# EAGLE design untitled (EAGLE 9.6.2)
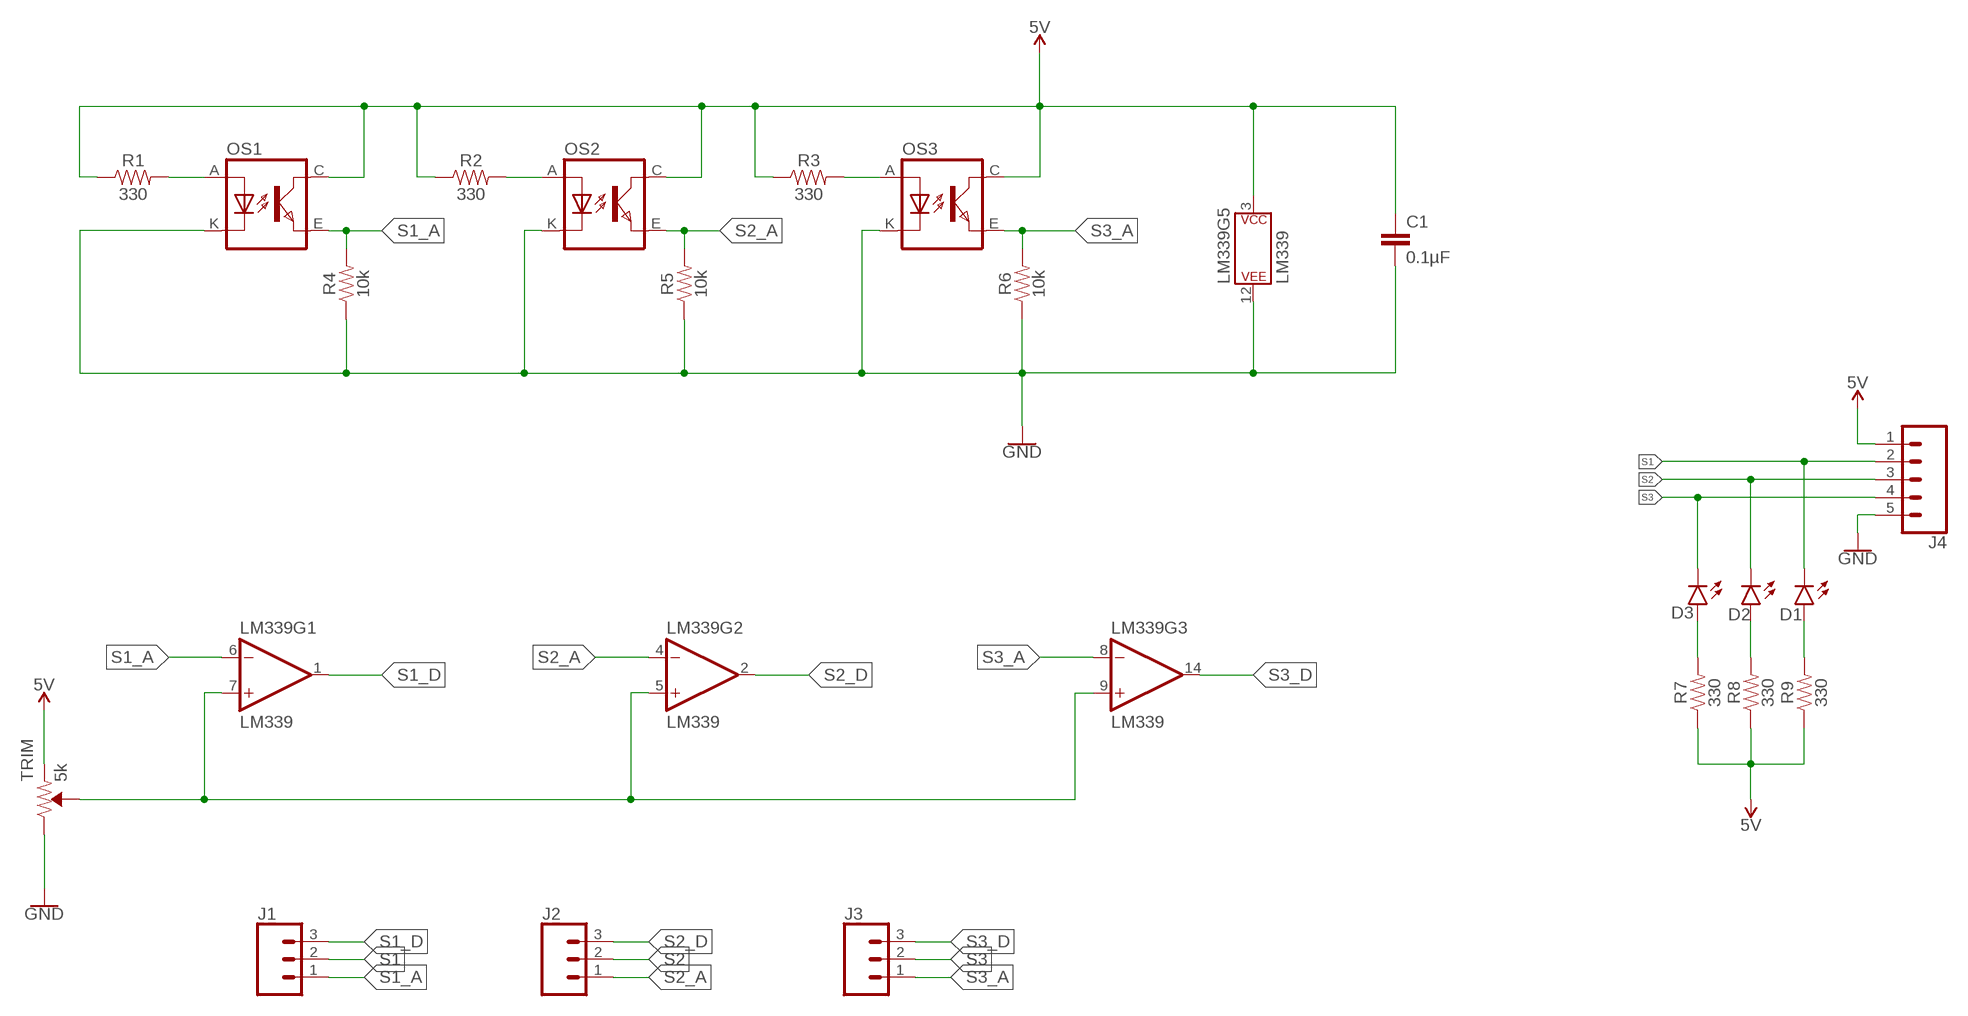
[diagram p0: schematic, sheet 1]

## Parts
C1  0.1µF  0.33UF/330NF-0805-50V-10%  [0805]
D1  LED-RED-0805  [LED-0805]
D2  LED-RED-0805  [LED-0805]
D3  LED-RED-0805  [LED-0805]
J1  CONN_03  [1X03]
J2  CONN_03  [1X03]
J3  CONN_03  [1X03]
J4  CONN_05PTH  [1X05]
LM339  LM339  [TSSOP-14]
OS1  TCRT5000  [TCRT5000]
OS2  TCRT5000  [TCRT5000]
OS3  TCRT5000  [TCRT5000]
R1  330  0.3OHM-0805-1/8W-1%  [0805]
R2  330  0.3OHM-0805-1/8W-1%  [0805]
R3  330  0.3OHM-0805-1/8W-1%  [0805]
R4  10k  0.3OHM-0805-1/8W-1%  [0805]
R5  10k  0.3OHM-0805-1/8W-1%  [0805]
R6  10k  0.3OHM-0805-1/8W-1%  [0805]
R7  330  0.3OHM-0805-1/8W-1%  [0805]
R8  330  0.3OHM-0805-1/8W-1%  [0805]
R9  330  0.3OHM-0805-1/8W-1%  [0805]
TRIM  5k  TRIMPOT-SMD-5MM-CLOSED-1/4W-20%  [TRIMPOT-SMD-5MM]

## Nets
5V: C1.1 J4.1 LM339.3(P$V+) OS1.C(COLLECTOR) OS2.C(COLLECTOR) OS3.C(COLLECTOR) R1.1 R2.1 R3.1 R7.1 R8.1 R9.1 TRIM.A(CCW)
GND: C1.2 J4.5 LM339.12(P$V-) OS1.K(CATHODE) OS2.K(CATHODE) OS3.K(CATHODE) R4.1 R5.1 R6.1 TRIM.C(CW)
N$1: OS1.A(ANODE) R1.2
N$2: OS2.A(ANODE) R2.2
N$3: OS3.A(ANODE) R3.2
N$4: LM339.5(+IN) LM339.7(+IN) LM339.9(+IN) TRIM.B(WIPER)
N$5: D3.A R7.2
N$6: D2.A R8.2
N$7: D1.A R9.2
S1: D1.C J1.2 J4.2
S1_A: J1.1 LM339.6(-IN) OS1.E(EMITTER) R4.2
S1_D: J1.3 LM339.1(OUT)
S2: D2.C J2.2 J4.3
S2_A: J2.1 LM339.4(-IN) OS2.E(EMITTER) R5.2
S2_D: J2.3 LM339.2(OUT)
S3: D3.C J3.2 J4.4
S3_A: J3.1 LM339.8(-IN) OS3.E(EMITTER) R6.2
S3_D: J3.3 LM339.14(OUT)
Unconnected: LM339.10(-IN) LM339.11(+IN) LM339.13(OUT)

## Library data of the parts
C1 = SparkFun-Capacitors:0.33UF/330NF: 0.33µF/330nF ceramic capacitors A capacitor is a passive two-terminal electrical component used to store electrical energy temporarily in an electric field.; PROD_ID: CAP-08469; VALUE: 0.33µF
D1-D3 = SparkFun-LED:LED-RED: Red SMD LED Used in manufacturing of most products at SparkFun Packages: 0603 - KB - KingBright (DIO-17976) SMD 0603 package [Datasheet] <https://www.kingbrightusa.com/images/catalog/SPEC/APT1608SURCK.pdf> 0603 - (DIO-00819, has gone EOL) SMD 0603 package 0603 SMART - SMD 0603 SMART package ( more efficient and expensive)[Product Link] <http://www.osram-os.com/Graphics/XPic2/00077099_0.pdf> 1206 - SMD1206 package [Product Link] <https://www.sparkfun.com/datasheets/DevTools/LilyPad/Q150OVS4.pdff> SparkFun Products: Pro Mini 328 -5V <https://www.sparkfun.com/products/821> RedBoard <https://www.sparkfun.com/products/12757> IOIO-OTG <https://www.sparkfun.com/products/13613>; PROD_ID: DIO-16865; VALUE: RED
J1-J3 = SparkFun-Connectors:CONN_03: Multi connection point. Often used as Generic Header-pin footprint for 0.1 inch spaced/style header connections On any of the 0.1 inch spaced packages, you can populate with these: Break Away Headers - Straight <https://www.sparkfun.com/products/116> (PRT-00116) Break Away Male Headers - Right Angle <https://www.sparkfun.com/products/553> (PRT-00553) Female Headers <https://www.sparkfun.com/products/115> (PRT-00115) Break Away Headers - Machine Pin <https://www.sparkfun.com/products/117> (PRT-00117) Break Away Female Headers - Swiss Machine Pin <https://www.sparkfun.com/products/743> (PRT-00743) Stackable Header - 3 Pin (Female, 0.1") <https://www.sparkfun.com/products/13875> (PRT-13875) For SCREWTERMINALS and SPRING TERMINALS visit here: Screw Terimnals on SparkFun.com <https://www.sparkfun.com/search/results?term=Screw+Terminals> (5mm/3.5mm/2.54mm spacing) This device is also useful as a general connection point to wire up your design to another part of your project. Our various solder wires solder well into these plated through hole pads. Hook-Up Wire - Assortment (Stranded, 22 AWG) <https://www.sparkfun.com/products/11375> (PRT-11375) Hook-Up Wire - Assortment (Solid Core, 22 AWG) <https://www.sparkfun.com/products/11367> (PRT-11367) View the entire wire category on our website here <https://www.sparkfun.com/categories/141> Special notes: Molex polarized connector foot print use with SKU : PRT-08232 with associated crimp pins and housings.; PROD_ID: XXX-00000; VALUE: 455-1750-1-ND
J4 = SparkFun-Connectors:CONN_05: Multi connection point. Often used as Generic Header-pin footprint for 0.1 inch spaced/style header connections On any of the 0.1 inch spaced packages, you can populate with these: Break Away Headers - Straight <https://www.sparkfun.com/products/116> (PRT-00116) Break Away Male Headers - Right Angle <https://www.sparkfun.com/products/553> (PRT-00553) Female Headers <https://www.sparkfun.com/products/115> (PRT-00115) Break Away Headers - Machine Pin <https://www.sparkfun.com/products/117> (PRT-00117) Break Away Female Headers - Swiss Machine Pin <https://www.sparkfun.com/products/743> (PRT-00743) For SCREWTERMINALS and SPRING TERMINALS visit here: Screw Terimnals on SparkFun.com <https://www.sparkfun.com/search/results?term=Screw+Terminals> (5mm/3.5mm/2.54mm spacing) This device is also useful as a general connection point to wire up your design to another part of your project. Our various solder wires solder well into these plated through hole pads. Hook-Up Wire - Assortment (Stranded, 22 AWG) <https://www.sparkfun.com/products/11375> (PRT-11375) Hook-Up Wire - Assortment (Solid Core, 22 AWG) <https://www.sparkfun.com/products/11367> (PRT-11367) View the entire wire category on our website here <https://www.sparkfun.com/categories/141> Special notes: Molex polarized connector foot print use with SKU : PRT-08231 with associated crimp pins and housings. 1MM SMD Version SKU: PRT-10208
LM339 = SparkFun-IC-Amplifiers:LM339: Quad Comparator - LM339PWR Based on information from the SLCS006N datasheet from TI (www.ti.com). Created by nick@scantool.net, 2008. Updated 2016. SparkFun Products SparkFun OBD-II UART <https://www.sparkfun.com/products/9555> (WIG-09555) SparkFun Car Diagnostics Kit <https://www.sparkfun.com/products/10769> (RTL-10769); PROD_ID: IC-09990; VALUE: LM339PWR
OS1-OS3 = tcrt5000:TCRT5000
R1-R9 = SparkFun-Resistors:0.3OHM: 0.3Ω resistor A resistor is a passive two-terminal electrical component that implements electrical resistance as a circuit element. Resistors act to reduce current flow, and, at the same time, act to lower voltage levels within circuits. - Wikipedia; PROD_ID: RES-11622; VALUE: 0.3
TRIM = SparkFun-Resistors:TRIMPOT: Trimming Potentiometer (Trimpot) Three-terminal potentiometers, with an adjustable wiper and two adjustable resistors. A pot can be used to create a configurable voltage divider, or as a variable resistor. "Trimpots" are a subset of potentiometers, usually intended for "set-and-forget" applications. They're often more delicate than standard potentiometers - rated for fewer turns. Variants PTH-KNOB - PTH Trimpot w/ finger-adjustable knob Trimpot 10K with Knob <https://www.sparkfun.com/products/9806> (COM-09806) Datasheet <http://www.sparkfun.com/datasheets/Components/General/TSR-3386.pdf> SMD-3MM-CLOSED-FRAME - SMD 3mm Square Closed-Frame Trimpot Used on e.g. EasyDriver - Stepper Motor Driver <https://www.sparkfun.com/products/12779> Datasheet <http://www.bitechnologies.com/pdfs/22.pdf> (22AR10KTR) SMD-5MM - SMD 5mm Square Closed-Frame Trimpot Used on e.g. IOIO-OTG - V2.2 <https://www.sparkfun.com/products/13613> Datasheet <http://www.vishay.com/docs/51008/ts53.pdf> (TS53YL502MR10) SMD-3MM-1/10W-25% - 3mm Square Open-Frame Trimpot Used on e.g. SparkFun Shapeoko <https://www.sparkfun.com/products/13899> Datasheet <http://www.bourns.com/docs/Product-Datasheets/TC33.pdf> (TC33X-2-103E); PROD_ID: RES-11156

## Board
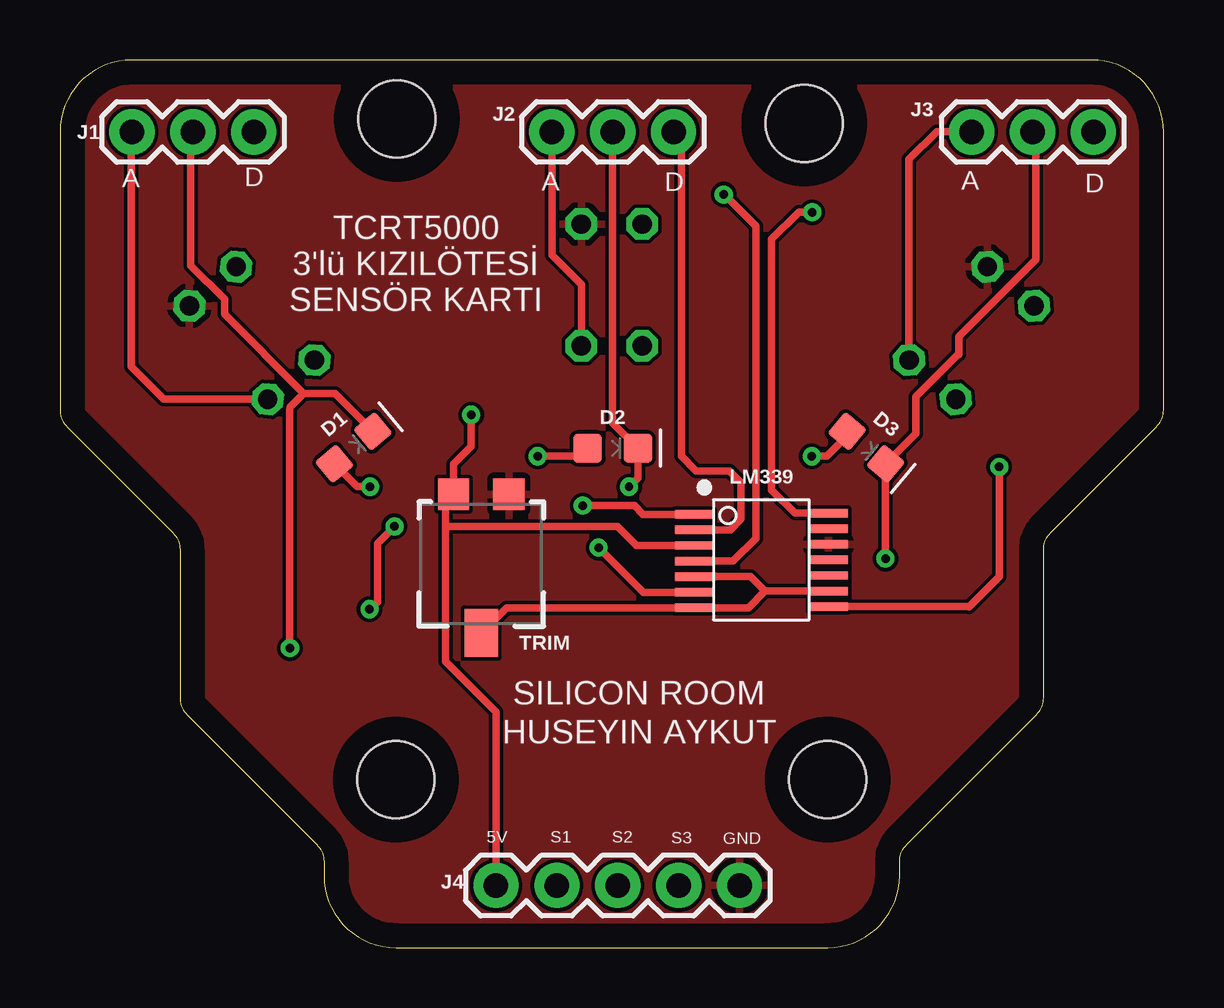
[diagram p1: board, top side]
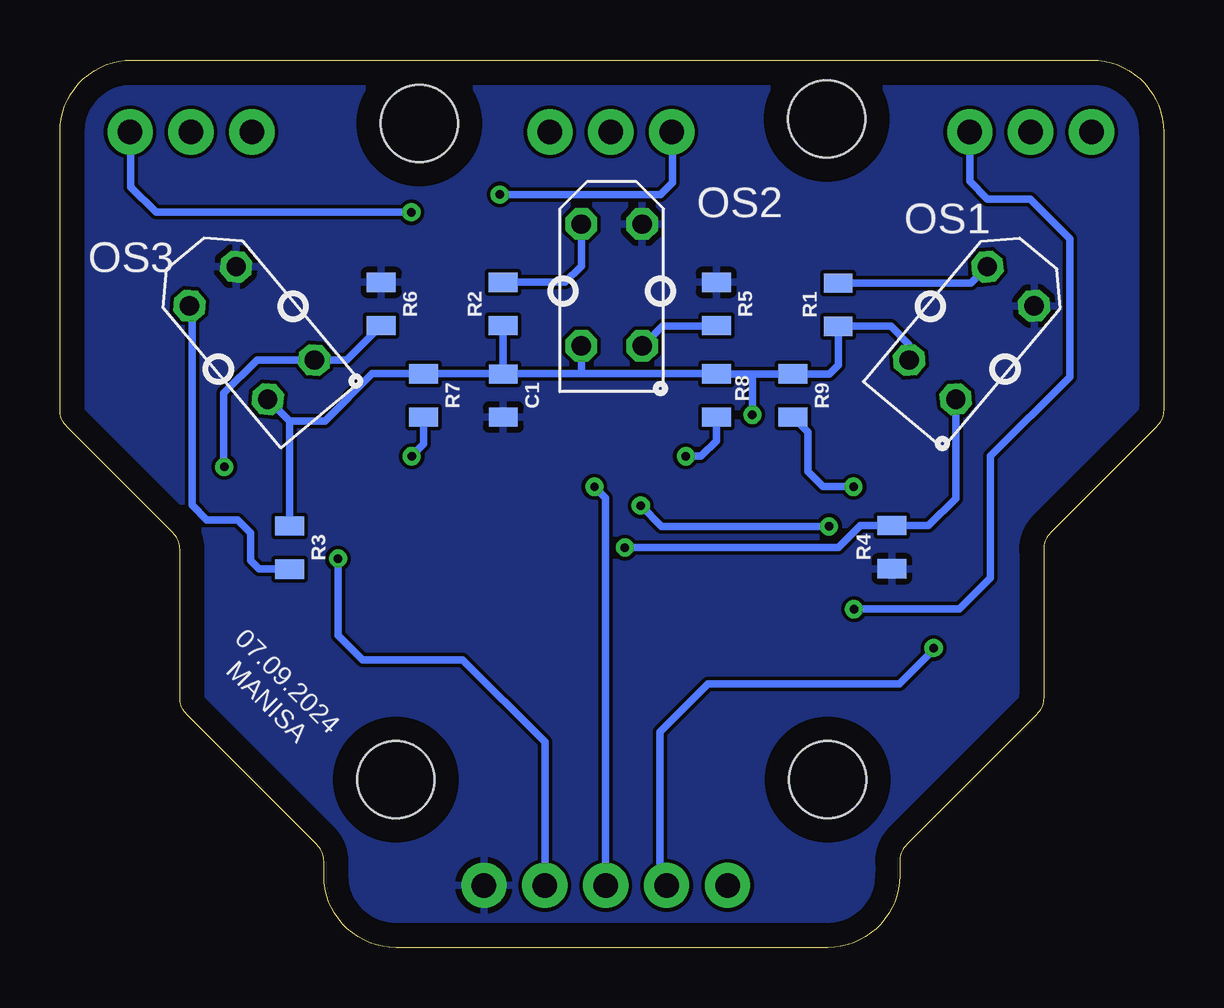
[diagram p2: board, bottom side, seen from below]

Size 46 x 37 mm. Coordinates in mm from the lower left corner, seen from the top.
Outline: 41.29,17.29 45.71,21.71 arc45 46,22.41 46,34 arc90 43,37 3,37 arc90 0,34 0,22.41 arc45 0.29,21.71 4.71,17.29 arc-45 5,16.59 5,10.41 arc45 5.29,9.71 10.71,4.29 arc-45 11,3.59 11,3 arc90 14,0 32,0 arc90 35,3 35,3.59 arc-45 35.29,4.29 40.71,9.71 arc45 41,10.41 41,16.59 arc-45 41.29,17.29
Copper layers (1*16): Top 0.035mm / dielectric 1.5mm / Bottom 0.035mm
Design rules "default": minimum track width 6mil, minimum drill 0.35mm, track to track 6mil, track to pad 6mil, pad to pad 6mil, via to via 6mil, smd to smd 6mil, copper to edge 40mil, drill to drill 6mil, minimum pad ring 10mil, minimum via ring 8mil, stop-mask expansion 4mil, vias tented up to drill 0mil, thermal gap 10mil
Holes 3.2 mm at 31.02,34.36 14.05,34.54 14,7 32,7

### Footprints (pad centres in the part's own frame; a part is rotated, then mirrored left to right if it is on the bottom)
0805 = smd 0.8 x 1.2: 1 -0.9,0; 2 0.9,0
LED-0805 = smd 1.2 x 1.2: A -1.05,0; C 1.05,0
1X03 = drill 1.016 pad 1.88: 1 0,0; 2 2.54,0; 3 5.08,0
1X05 = drill 1.016 pad 1.88: 1 0,0; 2 2.54,0; 3 5.08,0; 4 7.62,0; 5 10.16,0
TSSOP-14 = smd 1.6 x 0.35: 1 -2.8,1.9; 2 -2.8,1.25; 3 -2.8,0.6; 4 -2.8,-0.05; 5 -2.8,-0.7; 6 -2.8,-1.35; 7 -2.8,-2; 8 2.8,-1.95; 9 2.8,-1.3; 10 2.8,-0.65; 11 2.8,0; 12 2.8,0.65; 13 2.8,1.3; 14 2.8,1.95
TCRT5000 = drill 0.8 octagon: A -2.54,-1.27; C 2.54,-1.27; E 2.54,1.27; K -2.54,1.27
TRIMPOT-SMD-5MM = smd 1.3 x 1.3: A 1.15,-2.54; C -1.15,-2.54 | smd 1.402 x 2: B 0,3.239

### Placement (x,y rotation side)
C1  27.52,23.01 270 bottom
D1  12.24,20.84 40 top
D2  23.04,20.82 0 top
D3  33.61,20.84 320 top
J1  3,34 0 top
J2  20.5,34 0 top
J3  38,34 0 top
J4  18.17,2.59 0 top
LM339  29.24,16.16 0 top
OS1  8,25.62 230 bottom
OS2  23,27.62 270 bottom
OS3  38,25.62 310 bottom
R1  13.56,26.8 90 bottom
R2  27.53,26.83 90 bottom
R3  36.43,16.67 270 bottom
R4  11.32,16.69 90 bottom
R5  18.64,26.83 270 bottom
R6  32.61,26.83 270 bottom
R7  30.84,23.02 270 bottom
R8  18.64,23.02 270 bottom
R9  15.44,23.01 270 bottom
TRIM  17.56,16.35 180 top

### Tracks (layer width: path | path; a pad name or v marks a point on that pad's centre or on a via)
5V  (via drill 0.35)
  Top 0.305: v17.14,22.21 17.14,20.89 16.41,20.16 TRIM.A 16.08,18.56 16.08,17.56 | LM339.3 24.04,16.76 23.24,17.56 16.08,17.56 | 16.08,17.56 16.08,11.92 18.17,9.83 J4.1
  Bottom 0.305: OS1.C 10.61,25.15 11.36,25.9 R1.1 13.56,24.29 13.94,23.91 R9.1 17.12,23.91 | R3.1 36.43,21.94 | 36.43,21.94 OS3.C | R2.1 C1.1 | C1.1 27.53,23.92 R7.1 32.98,23.92 34.96,21.94 36.43,21.94 | 24.3,23.92 R8.1 17.12,23.91 | 24.3,23.92 C1.1 | OS2.C 24.27,23.95 24.3,23.92 | v17.14,22.21 17.14,23.89 17.12,23.91
GND
  pour Top: -5,40 -5,-3 48,-3 51,-3 51,40
  pour Bottom: -7,42 -7,-6 54,-6 54,43 53,43 -7,43
N$1
  Bottom 0.305: R1.2 8.02,27.7 OS1.A
N$2
  Bottom 0.305: R2.2 24.95,27.73 24.27,28.41 OS2.A
N$3
  Bottom 0.305: OS3.A 40.5,26.64 40.5,18.45 39.89,17.83 38.6,17.83 38.05,17.28 38.05,16.14 37.69,15.77 R3.2
N$4
  Top 0.305: LM339.5 28.79,15.46 29.39,14.86 | 29.39,14.86 LM339.9 | 29.39,14.86 28.69,14.16 LM339.7 18.61,14.16 TRIM.B
N$5  (via drill 0.35)
  Top 0.305: v31.34,20.48 31.98,20.48 32.81,21.31 D3.A
  Bottom 0.305: R7.2 30.84,20.98 v31.34,20.48
N$6  (via drill 0.35)
  Top 0.305: D2.A 21.65,20.48 v19.91,20.48
  Bottom 0.305: v19.91,20.48 19.27,20.48 18.64,21.11 R8.2
N$7  (via drill 0.35)
  Top 0.305: D1.A 12.39,19.21 v12.92,19.21
  Bottom 0.305: v12.92,19.21 14.2,19.21 14.83,19.84 14.83,21.5 R9.2
S1  (via drill 0.35)
  Top 0.305: 10.16,23.1 11.47,23.1 D1.C | 10.16,23.1 6.85,26.4 6.85,27.03 5.46,28.43 5.46,33.92 J1.2 | v9.58,12.48 9.58,22.4 9.59,22.53 10.16,23.1
  Bottom 0.305: J4.2 21,2.88 21,9 19,11 11,11 9.55,12.45 v9.58,12.48
S1_A  (via drill 0.35)
  Top 0.305: v22.45,16.67 24.32,14.8 24.34,14.81 LM339.6 | OS1.E 4.32,22.86 2.97,24.21 2.97,33.97 J1.1
  Bottom 0.305: OS1.E 8.66,18.73 9.8,17.58 R4.2 12.64,17.59 13.56,16.67 v22.45,16.67
S1_D  (via drill 0.35)
  Top 0.305: LM339.1 24.31,18.06 23.95,18.42 22.45,18.42 v21.79,18.42 | v13.94,17.56 13.23,16.85 13.23,14.41 12.92,14.11 v12.9,14.11
  Bottom 0.305: J1.3 8.08,31.94 7.34,31.2 5.56,31.2 3.91,29.55 3.91,23.78 7.21,20.48 7.21,15.4 8.5,14.11 v12.9,14.11 | v21.79,18.42 20.93,17.56 v13.94,17.56
S2  (via drill 0.35)
  Top 0.305: J2.2 23.04,21.86 D2.C 24.09,19.58 v23.72,19.21
  Bottom 0.305: v23.72,19.21 23.25,18.74 J4.3
S2_A  (via drill 0.35)
  Top 0.305: OS2.E 21.73,27.63 20.5,28.86 J2.1 | LM339.4 28.06,16.11 29,17.05 29,30.08 27.68,31.4 v27.67,31.39
  Bottom 0.305: OS2.E 20.89,25.92 18.65,25.92 R5.2 | v27.67,31.39 20.96,31.39 20.47,31.88 20.47,33.97 J2.1
S2_D
  Top 0.305: LM339.2 27.94,17.41 28.39,17.86 28.39,19.39 27.91,19.87 26.51,19.87 25.9,20.48 25.9,33.68 J2.3
S3  (via drill 0.35)
  Top 0.305: J3.2 40.69,33.85 40.69,28.68 37.46,25.46 37.46,24.72 37.44,24.72 35.68,22.97 35.68,21.43 D3.C 34.42,16.24 34.41,16.24 v34.41,16.21
  Bottom 0.305: J4.4 25.79,8.58 29.21,12 33.39,12 34.41,13.02 v34.41,16.21
S3_A  (via drill 0.35)
  Top 0.305: OS3.E 35.39,32.87 36.55,34.02 37.98,34.02 J3.1 | v39.15,20.04 39.15,15.47 37.89,14.21 LM339.8
  Bottom 0.305: R6.2 34.05,24.49 OS3.E 37.78,24.49 39.17,23.11 39.17,20.05 v39.15,20.04
S3_D  (via drill 0.35)
  Top 0.305: LM339.14 30.64,18.11 29.66,19.08 29.66,29.52 30.79,30.65 v31.35,30.65
  Bottom 0.305: v31.35,30.65 41.99,30.65 43.05,31.71 43.05,33.97 J3.3

### Text on the board
tNames: A | D | A | D | A | D | TCRT5000 / 3'lü KIZILÖTESİ / SENSÖR KARTI | SILICON ROOM / HUSEYIN AYKUT | 5V | S1 | S2 | S3 | GND
bNames: 07.09.2024 / MANISA